# EasyEDA schematic SCH_Line-Follower-proof-of-concepts_2025-12-12.json

## Sheets
1 Sensor proof of concept: TITLE: Sensor Proof of concept; REV: 1.0; Date: 2025-12-12; Sheet: 1/1; Drawn By: Ruben Van Landuyt; Company: Your Company
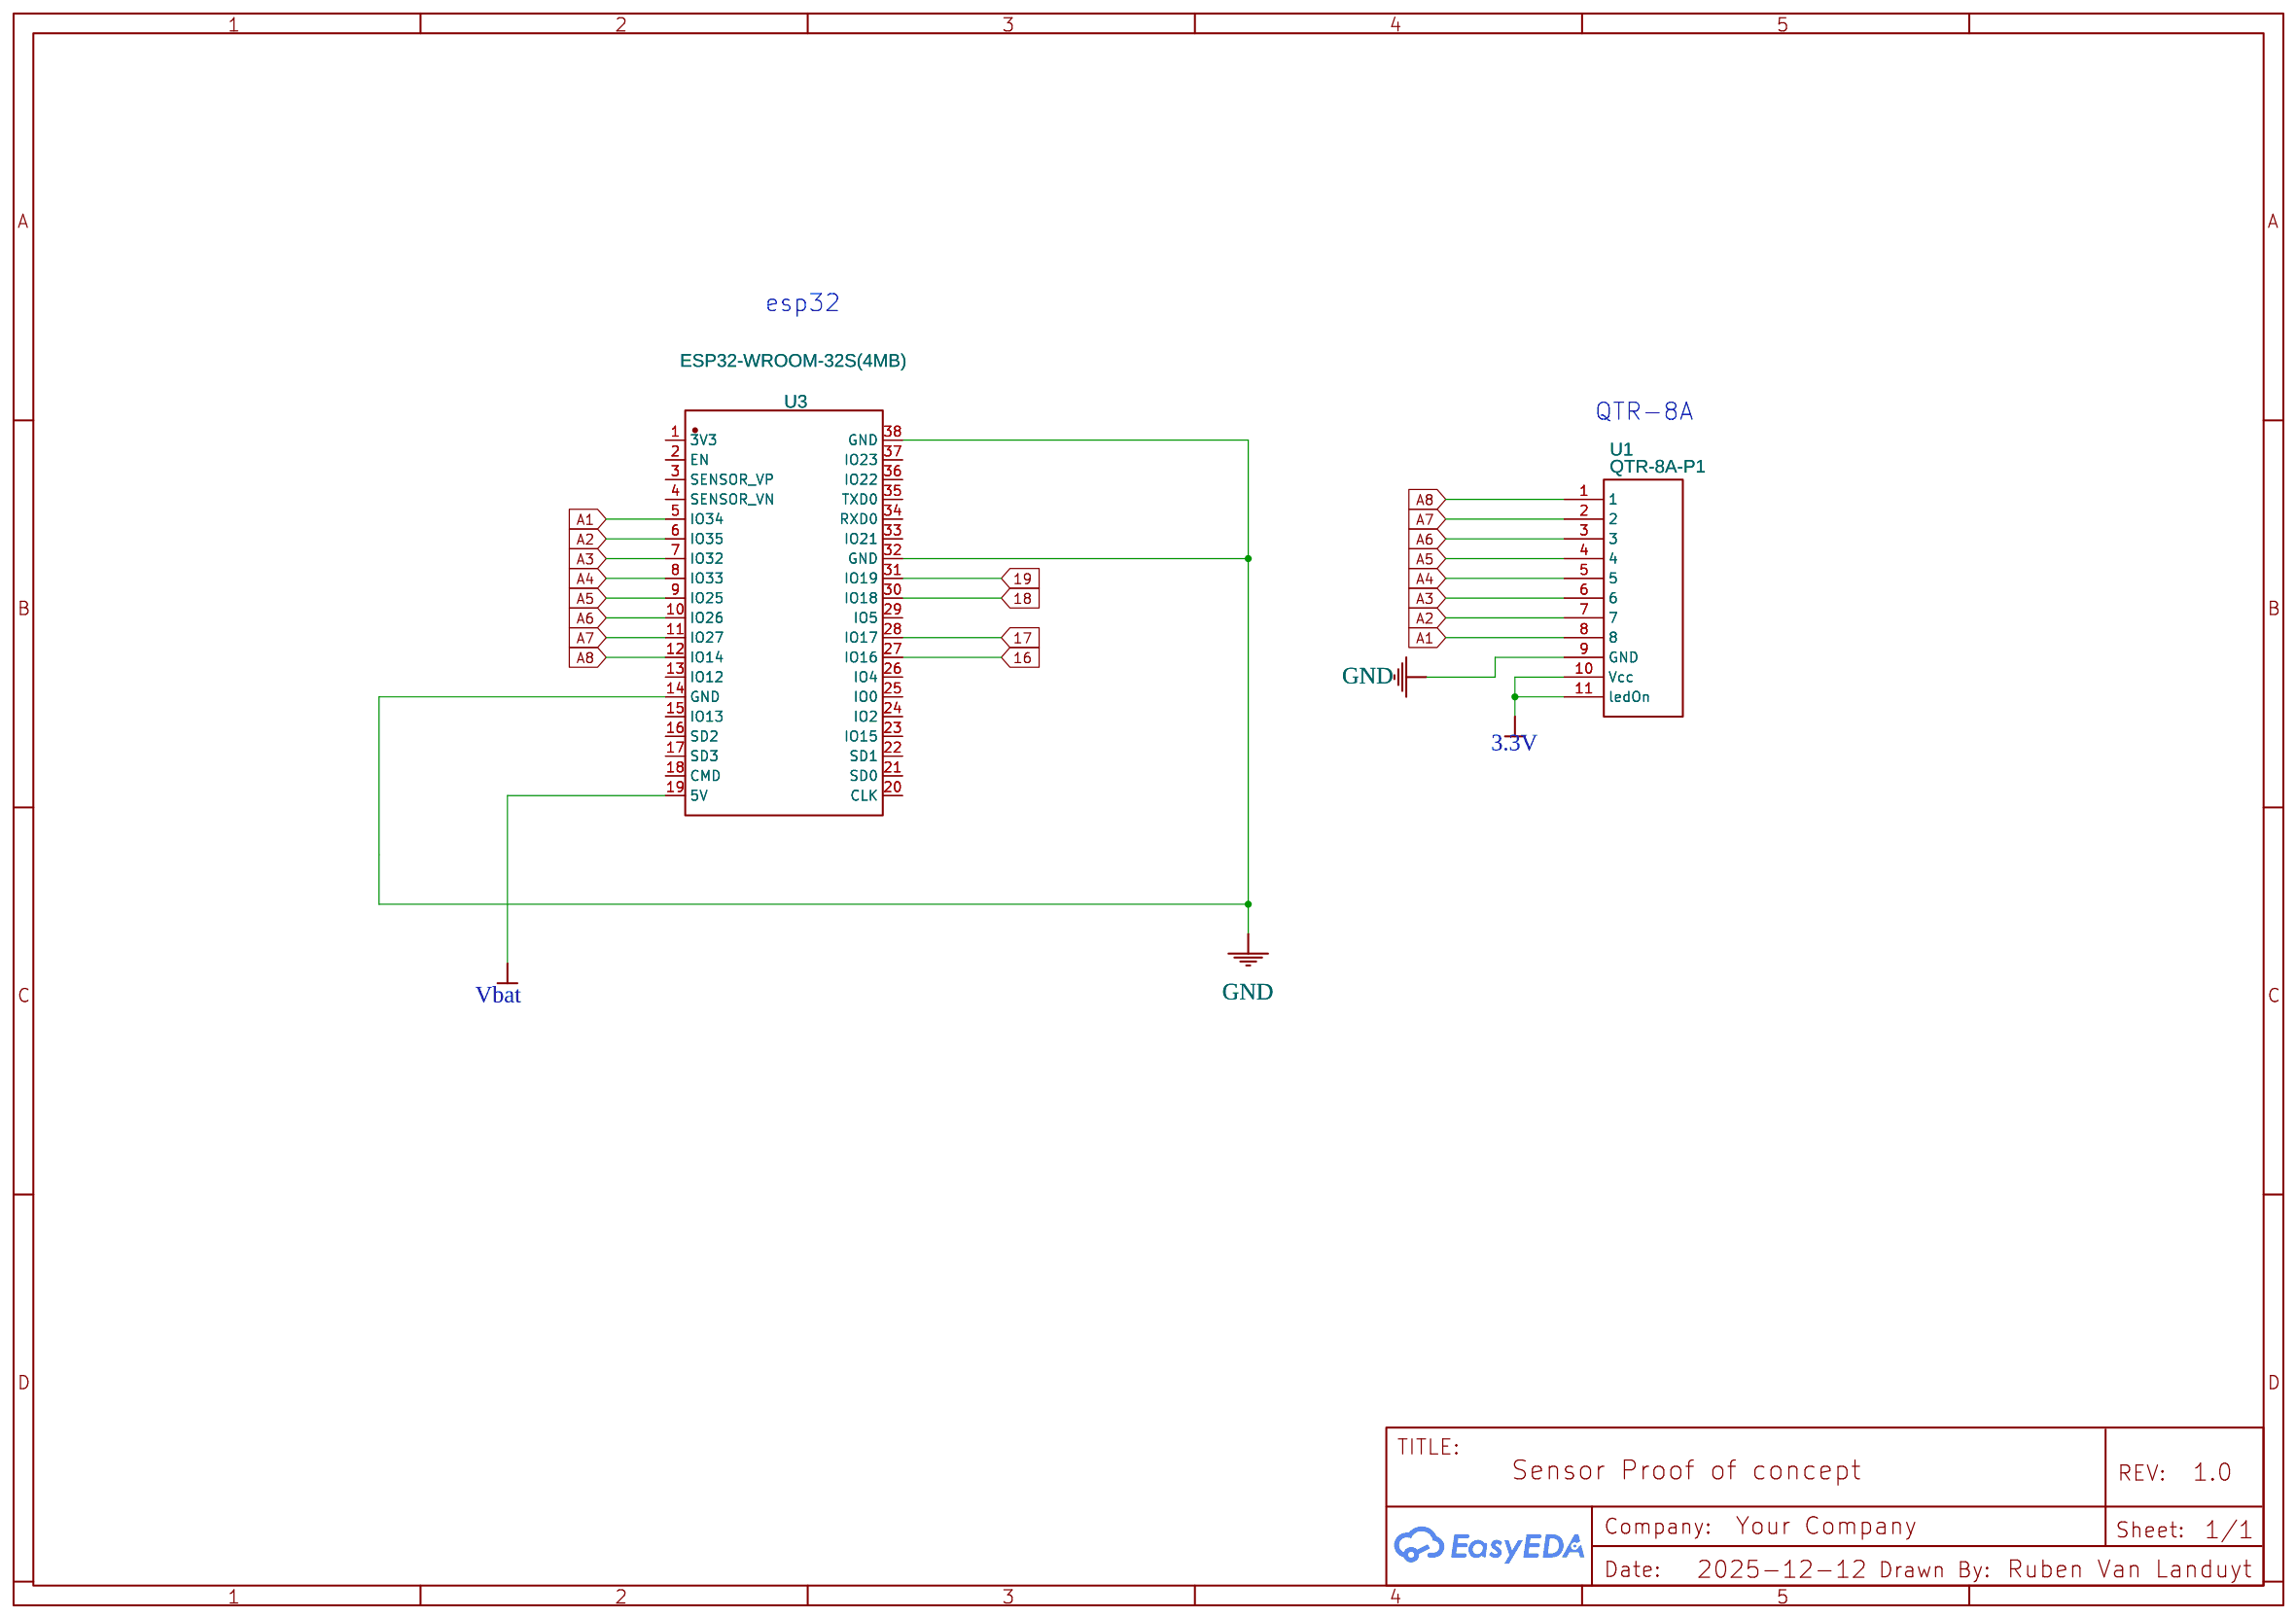
[diagram p0: Sensor proof of concept]
2 Sheet_2: TITLE: Sheet_2; Drawn By: rubenvl3
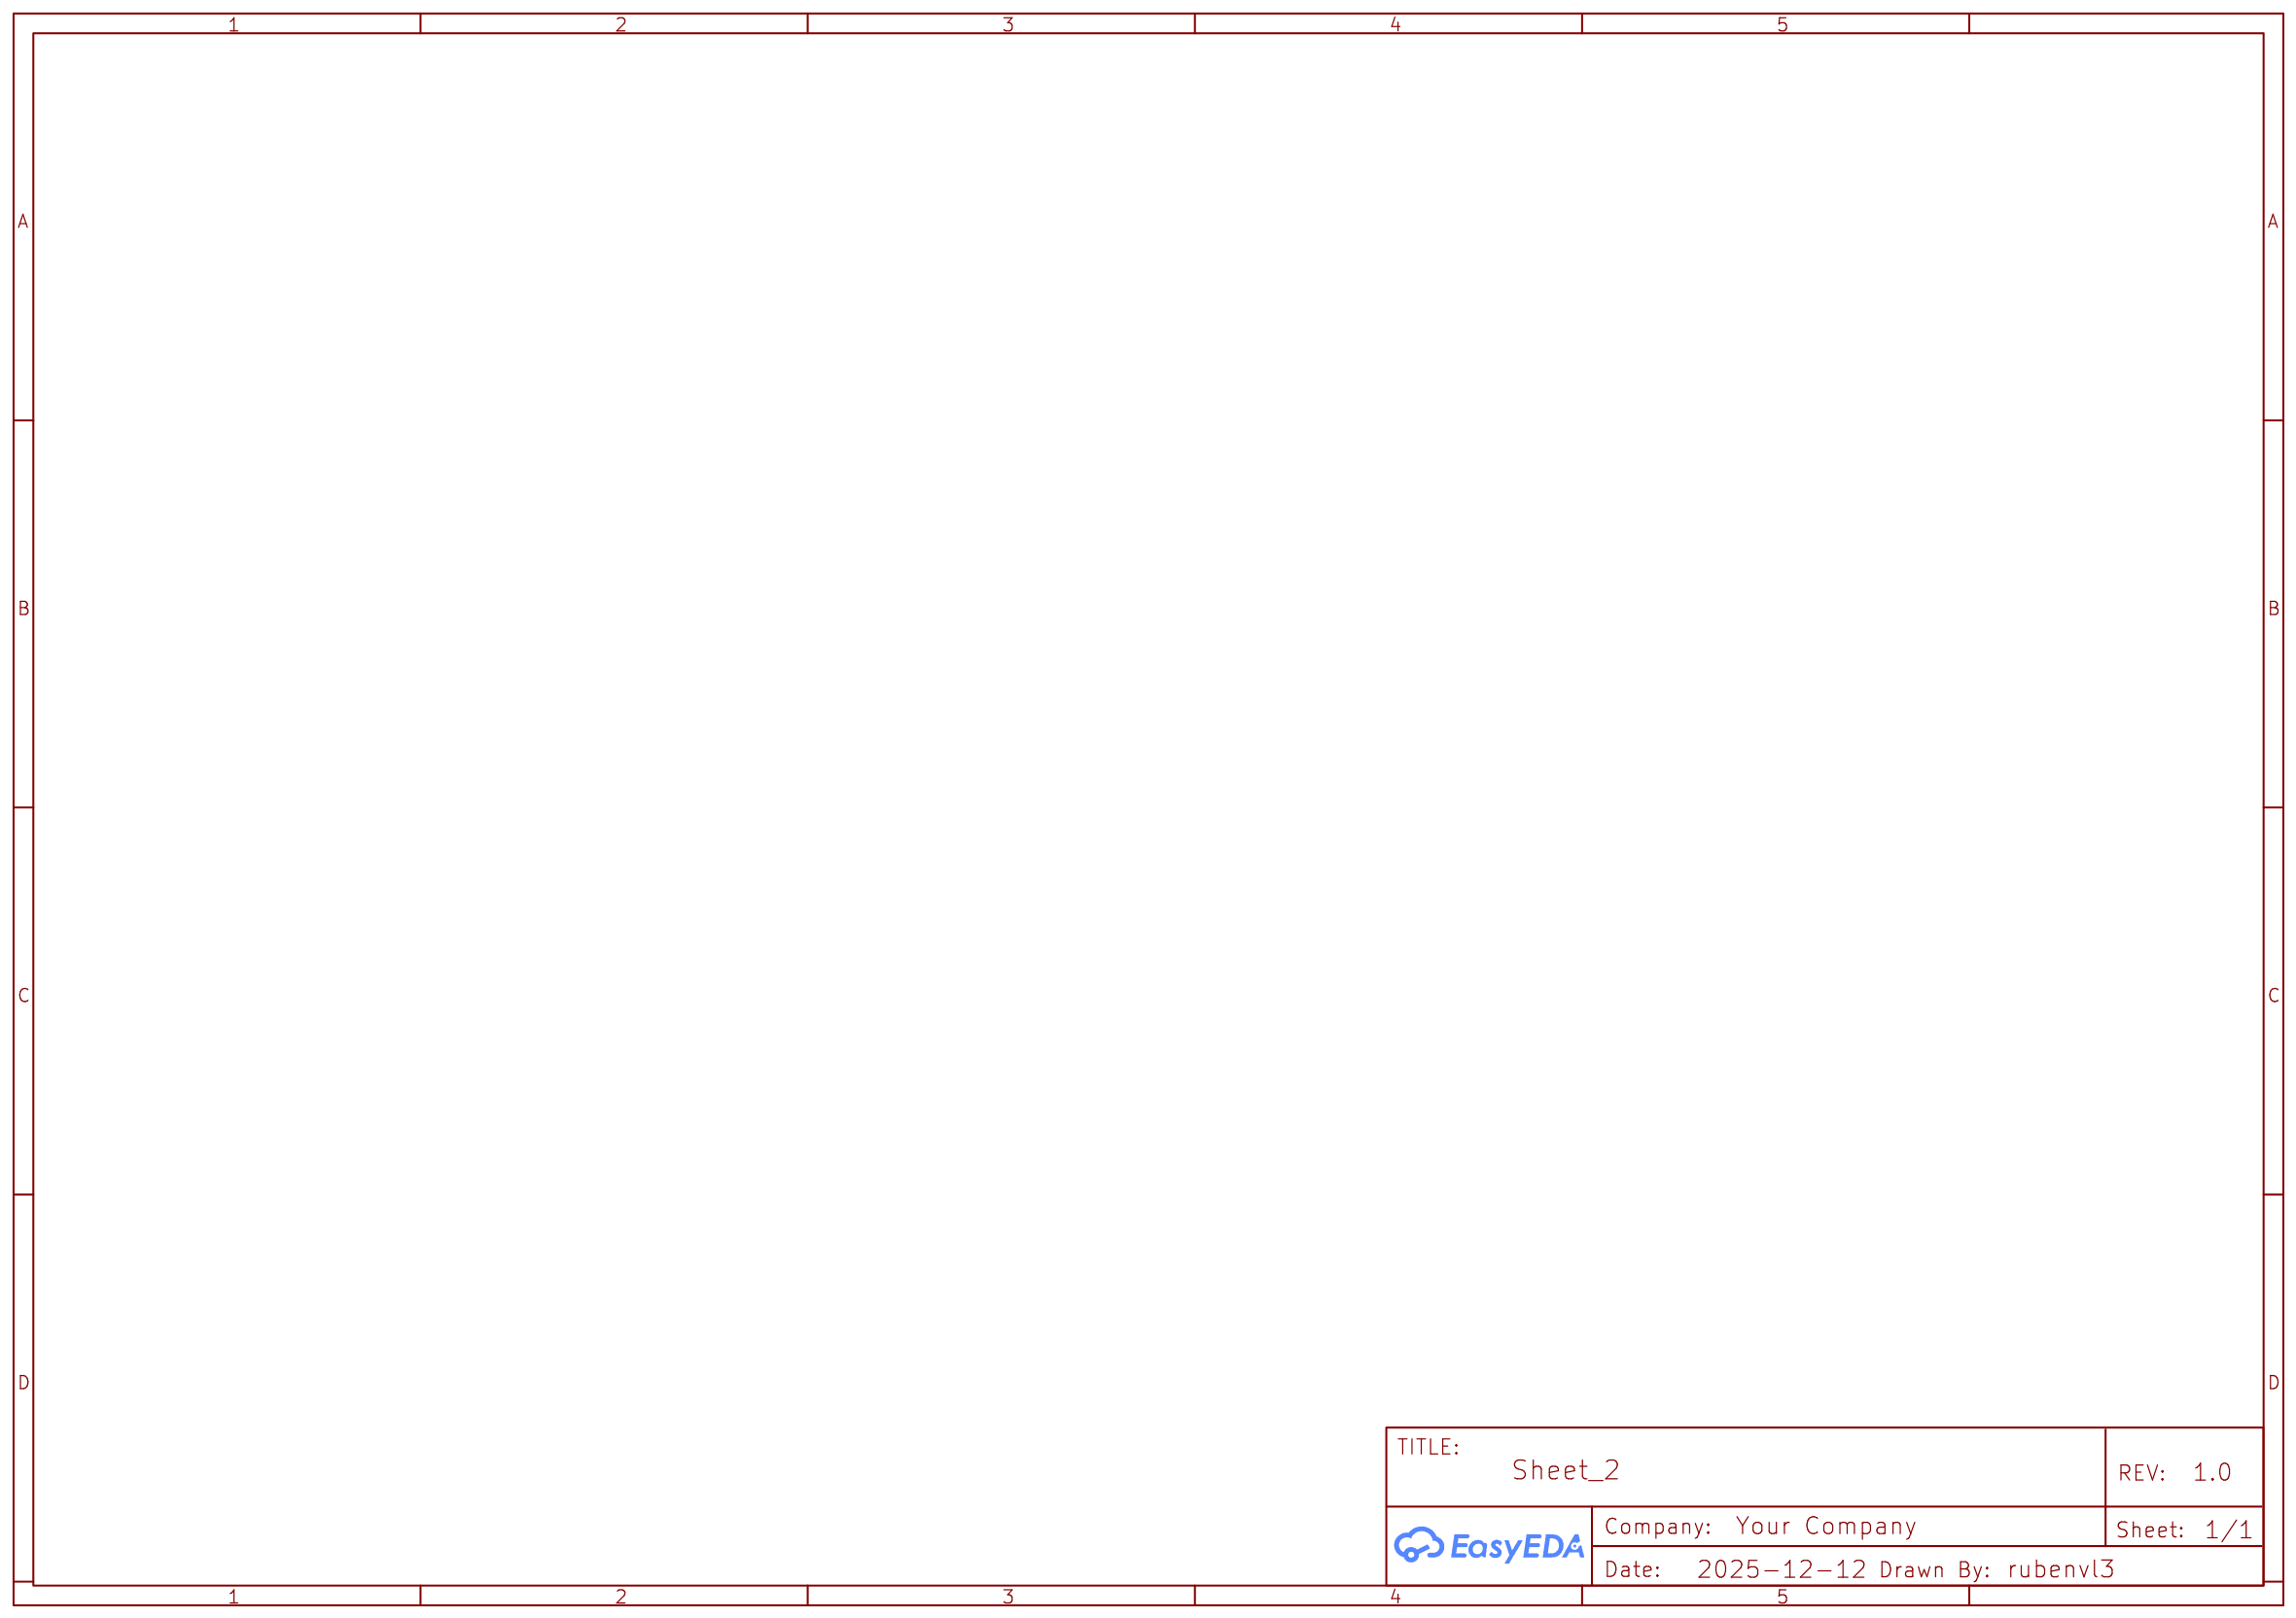
[diagram p1: Sheet_2]
3 ESP32 Wroom: TITLE: MC ESP32 Wroom 32S; Company: Hogent
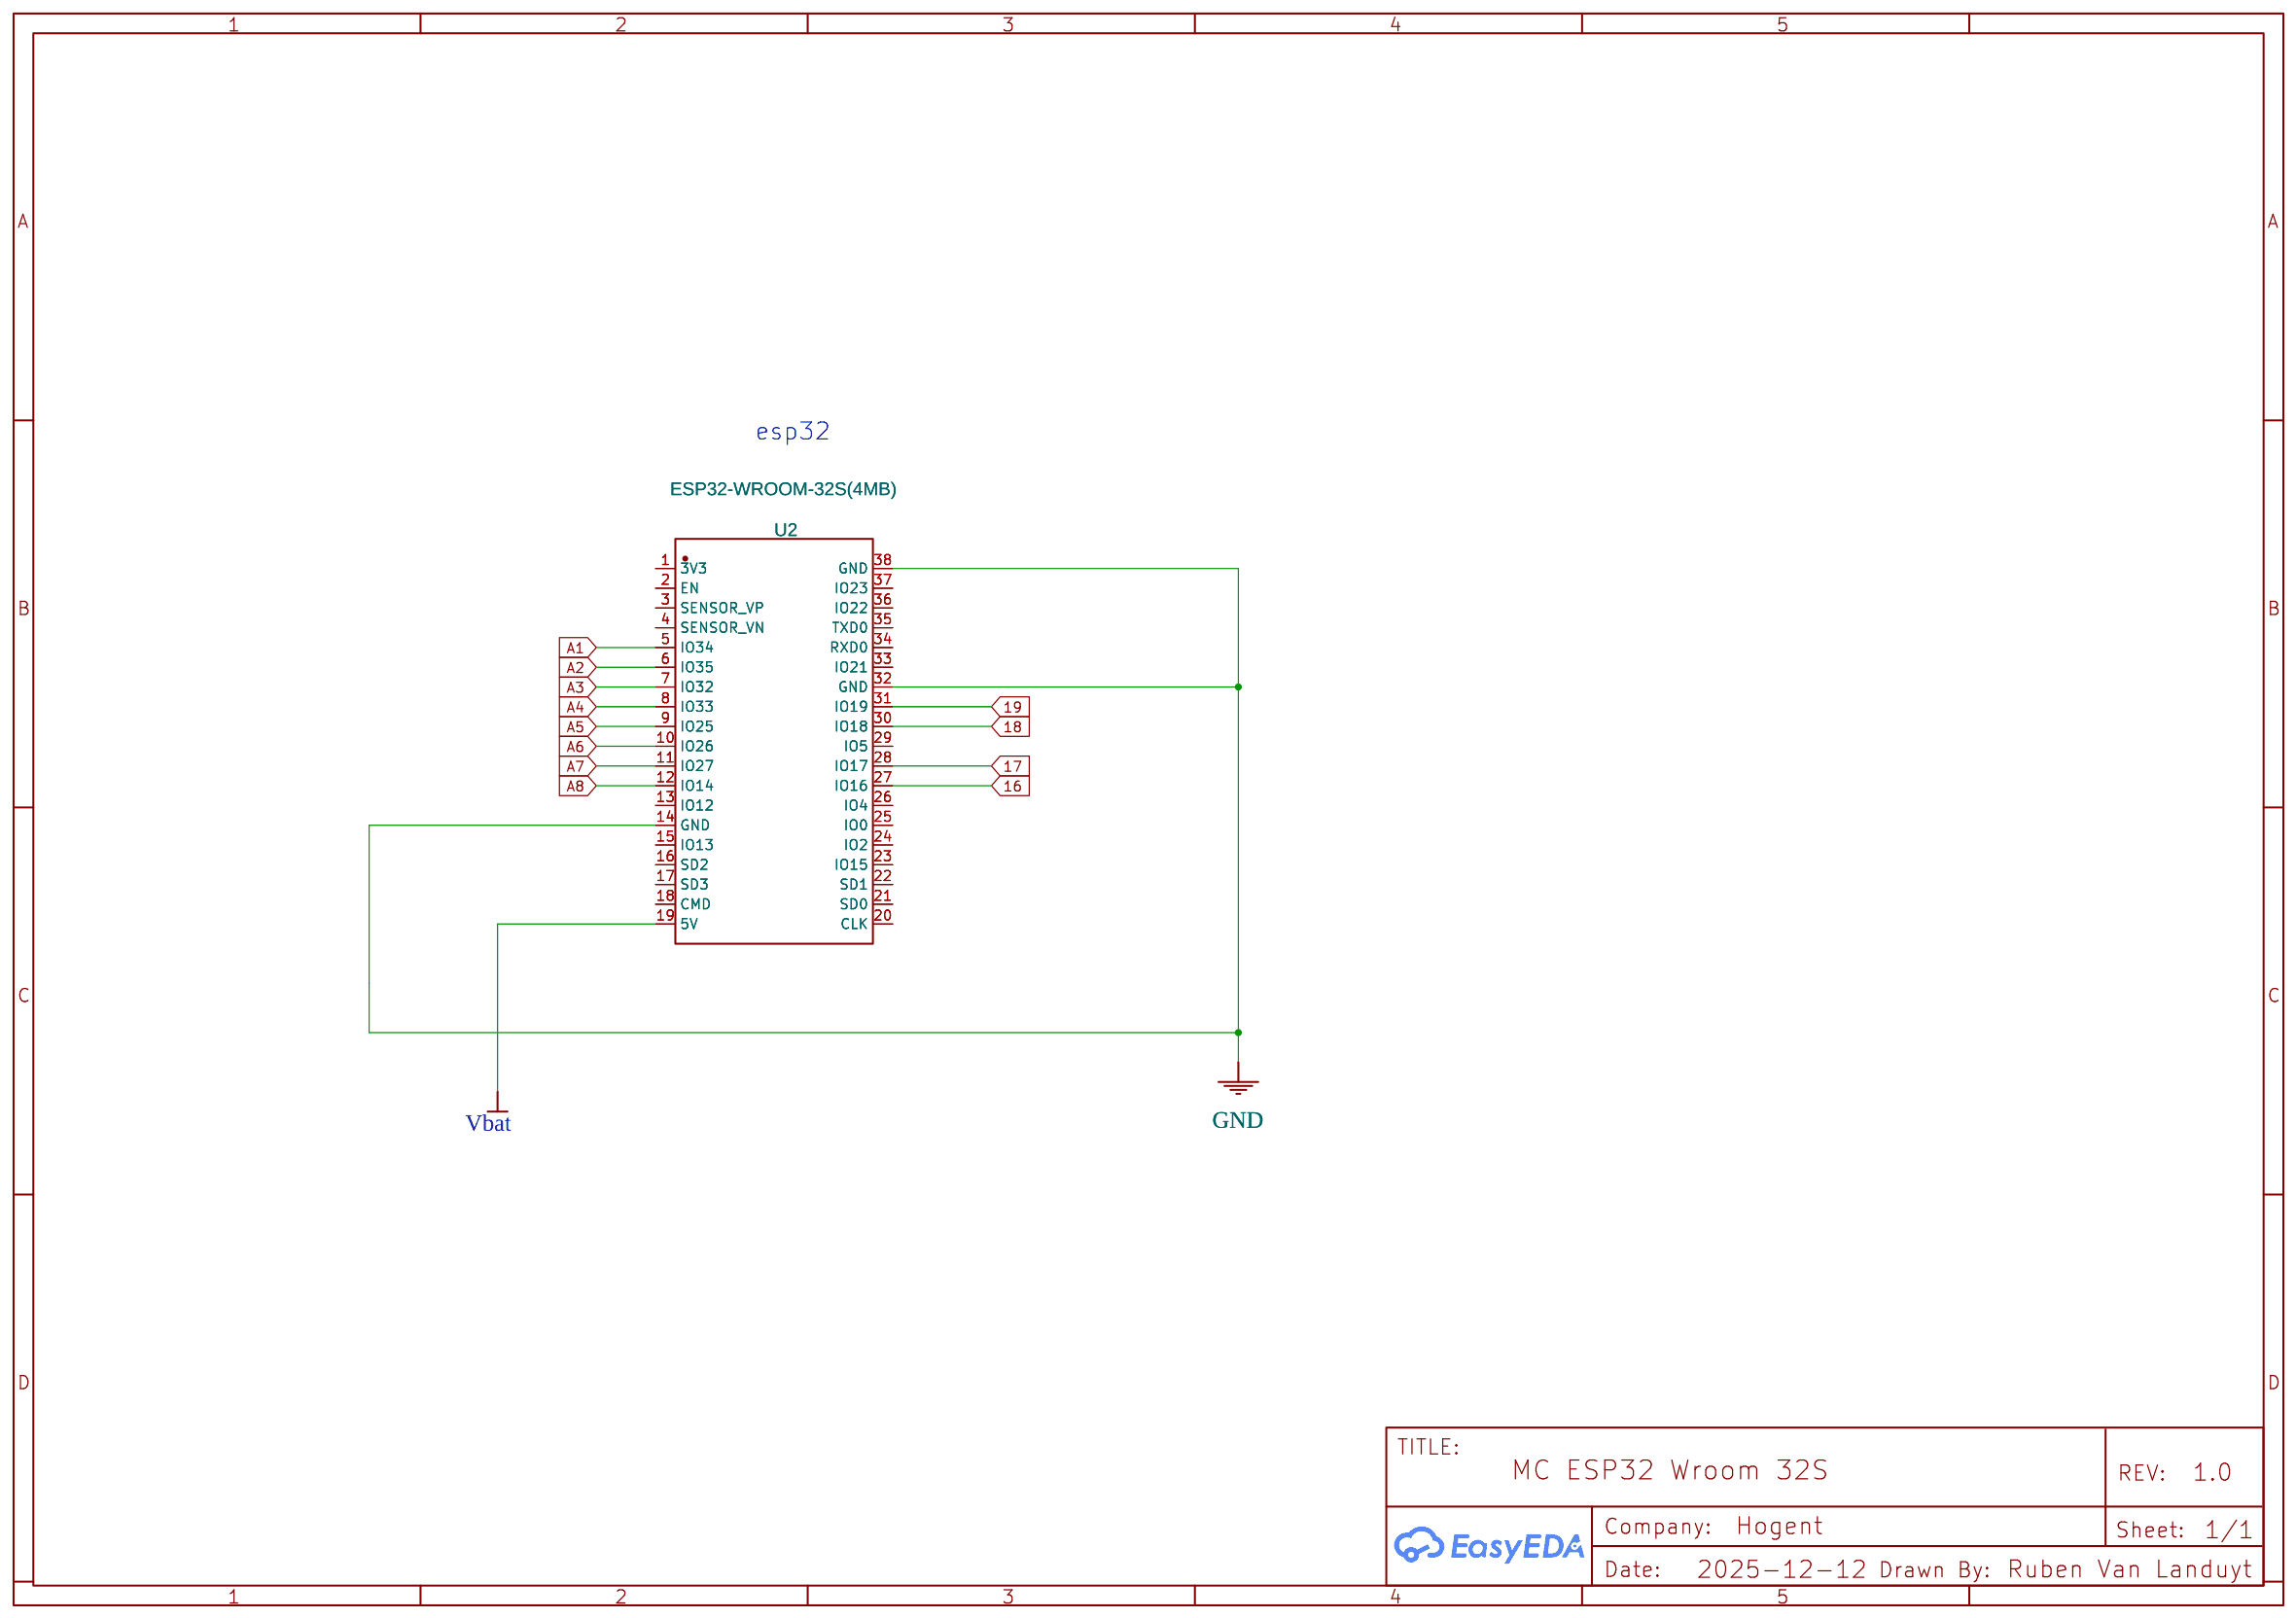
[diagram p2: ESP32 Wroom]

## Parts
sheet ESP32 Wroom
U2  ESP32-WROOM-32S(4MB)  [WIFIM-SMD_39P-L19.2-W18.0-P1.27]
sheet Sensor proof of concept
U1  QTR-8A-P1  [QTR-8A-P1]
U3  ESP32-WROOM-32S(4MB)  [WIFIM-SMD_39P-L19.2-W18.0-P1.27]

## Library data of the parts
U2 U3 = ESP32-WROOM-32S(4MB): Supplier: LCSC; Supplier Part: C529580; Manufacturer: Espressif Systems; Contributor: Aaron Hentschel; JLCPCB Part Class: Extended Part
U1 = QTR-8A-P1: Contributor: stan_goditiabois

## Nets
3.3V: U1.10(Vcc) U1.11(ledOn)
GND: U1.9(GND) U2.14(GND) U2.32(GND) U2.38(GND) U3.14(GND) U3.32(GND) U3.38(GND)
Vbat: U2.19(5V) U3.19(5V)
16: U2.27(IO16) U3.27(IO16)
17: U2.28(IO17) U3.28(IO17)
18: U2.30(IO18) U3.30(IO18)
19: U2.31(IO19) U3.31(IO19)
A1: U1.8 U2.5(IO34) U3.5(IO34)
A2: U1.7 U2.6(IO35) U3.6(IO35)
A3: U1.6 U2.7(IO32) U3.7(IO32)
A4: U1.5 U2.8(IO33) U3.8(IO33)
A5: U1.4 U2.9(IO25) U3.9(IO25)
A6: U1.3 U2.10(IO26) U3.10(IO26)
A7: U1.2 U2.11(IO27) U3.11(IO27)
A8: U1.1 U2.12(IO14) U3.12(IO14)

Not connected (* = marked no-connect by the designer): U2 1(3V3) 2(EN) 3(SENSOR_VP) 4(SENSOR_VN) 13(IO12) 15(IO13) 16(SD2) 17(SD3) 18(CMD) 20(CLK) 21(SD0) 22(SD1) 23(IO15) 24(IO2) 25(IO0) 26(IO4) 29(IO5) 33(IO21) 34(RXD0) 35(TXD0) 36(IO22) 37(IO23); U3 1(3V3) 2(EN) 3(SENSOR_VP) 4(SENSOR_VN) 13(IO12) 15(IO13) 16(SD2) 17(SD3) 18(CMD) 20(CLK) 21(SD0) 22(SD1) 23(IO15) 24(IO2) 25(IO0) 26(IO4) 29(IO5) 33(IO21) 34(RXD0) 35(TXD0) 36(IO22) 37(IO23)

## Notes on the sheets
sheet 1
- esp32
- QTR-8A
sheet 3
- esp32
